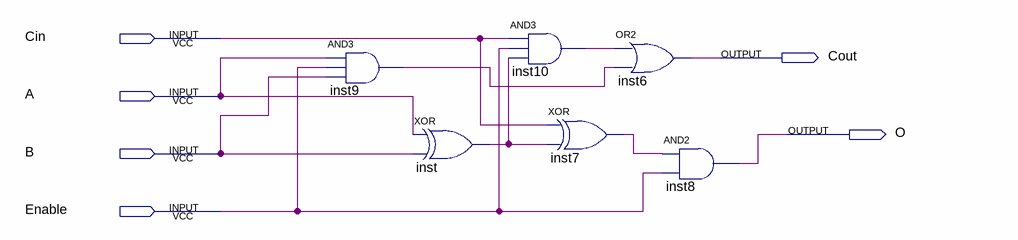
[diagram p0: schematic sheet]
// Quartus schematic full_adder_1bit.bdf as structural Verilog: 6 symbols, 6 pins
module full_adder_1bit (
  input  Cin,
  input  A,
  input  B,
  input  Enable,
  output Cout,
  output O
);

  wire inst7_out, inst9_out, inst10_out, inst_out;

  and inst9 (inst9_out, A, Enable, B);
  xor inst (inst_out, A, B);
  and inst10 (inst10_out, Cin, Enable, inst_out);
  xor inst7 (inst7_out, Cin, inst_out);
  or inst6 (Cout, inst10_out, inst9_out);
  and inst8 (O, inst7_out, Enable);
endmodule
